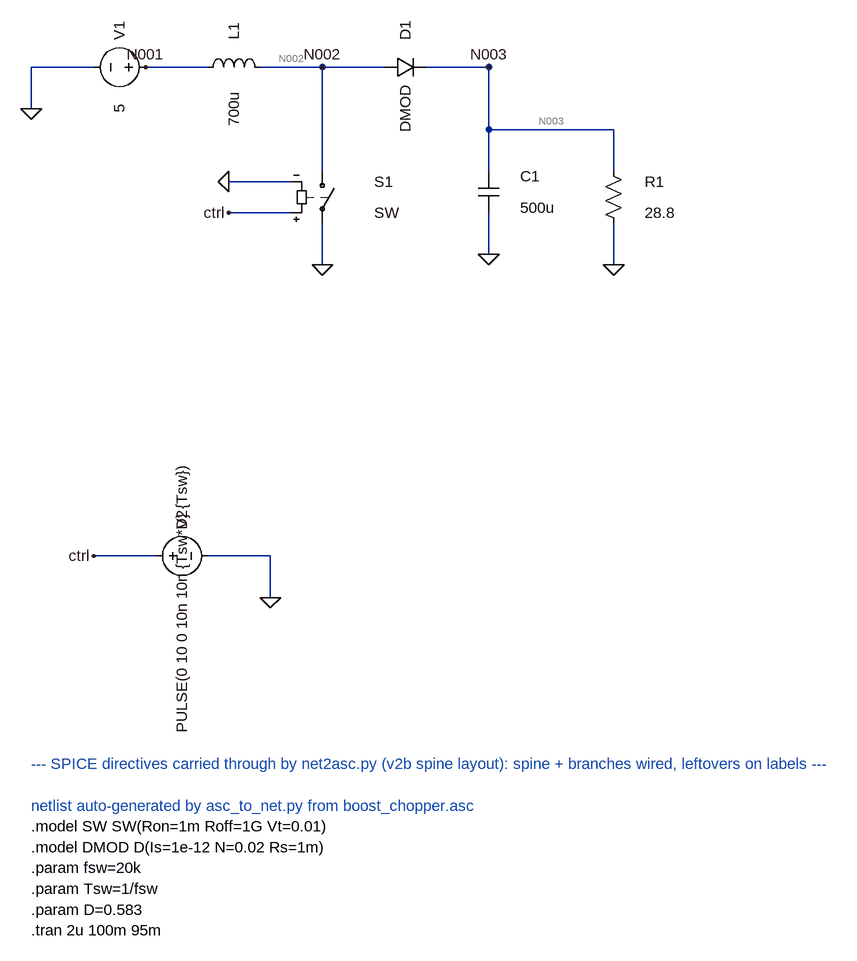
[diagram p0: schematic boost_chopper.asc]
boost_chopper.asc, the LTspice schematic file:
Version 4
SHEET 1 2080 1648
WIRE 64 128 64 192
WIRE 64 128 160 128
WIRE 240 128 336 128
WIRE 416 128 512 128
WIRE 512 128 608 128
WIRE 672 128 768 128
WIRE 512 128 512 224
WIRE 512 224 512 288
WIRE 464 352 368 352
WIRE 464 304 368 304
WIRE 512 368 512 432
WIRE 768 128 768 224
WIRE 768 224 768 288
WIRE 768 352 768 416
WIRE 768 128 768 224
WIRE 768 224 960 224
WIRE 960 224 960 288
WIRE 960 368 960 432
WIRE 160 880 256 880
WIRE 336 880 432 880
WIRE 432 880 432 944
FLAG 64 192 0
FLAG 512 128 N002
FLAG 768 128 N003
FLAG 368 352 ctrl
FLAG 368 304 0
FLAG 512 432 0
FLAG 768 416 0
FLAG 960 432 0
FLAG 160 880 ctrl
FLAG 432 944 0
FLAG 240 128 N001
SYMBOL voltage 256 128 R90
WINDOW 0 -56 56 Center 2
WINDOW 3 64 56 Center 2
SYMATTR InstName V1
SYMATTR Value 5
SYMBOL ind 320 144 R270
WINDOW 0 72 56 Center 2
WINDOW 3 -48 56 Center 2
SYMATTR InstName L1
SYMATTR Value 700u
SYMBOL diode 608 144 R270
WINDOW 0 72 32 Center 2
WINDOW 3 -48 32 Center 2
SYMATTR InstName D1
SYMATTR Value DMOD
SYMBOL sw 512 272 R0
WINDOW 0 80 32 Left 2
WINDOW 3 80 80 Left 2
SYMATTR InstName S1
SYMATTR Value SW
SYMBOL cap 752 288 R0
WINDOW 0 64 8 Left 2
WINDOW 3 64 56 Left 2
SYMATTR InstName C1
SYMATTR Value 500u
SYMBOL res 944 272 R0
WINDOW 0 64 32 Left 2
WINDOW 3 64 80 Left 2
SYMATTR InstName R1
SYMATTR Value 28.8
SYMBOL voltage 240 880 R270
WINDOW 0 56 56 Center 2
WINDOW 3 -64 56 Center 2
SYMATTR InstName V2
SYMATTR Value PULSE(0 10 0 10n 10n {Tsw*D} {Tsw})
TEXT 64 1200 Left 2 ;--- SPICE directives carried through by net2asc.py (v2b spine layout): spine + branches wired, leftovers on labels ---
TEXT 64 1264 Left 2 ;netlist auto-generated by asc_to_net.py from boost_chopper.asc
TEXT 64 1296 Left 2 !.model SW SW(Ron=1m Roff=1G Vt=0.01)
TEXT 64 1328 Left 2 !.model DMOD D(Is=1e-12 N=0.02 Rs=1m)
TEXT 64 1360 Left 2 !.param fsw=20k
TEXT 64 1392 Left 2 !.param Tsw=1/fsw
TEXT 64 1424 Left 2 !.param D=0.583
TEXT 64 1456 Left 2 !.tran 2u 100m 95m

The netlist it stands for:
* boost_chopper.asc
V1 N001 0 5
L1 N001 N002 700u
D1 N002 N003 DMOD
S1 N002 0 ctrl 0 SW
C1 N003 0 500u
R1 N003 0 28.8
V2 ctrl 0 PULSE(0 10 0 10n 10n {Tsw*D} {Tsw})
.model D D
.lib standard.dio
* --- SPICE directives carried through by net2asc.py (v2b spine layout): spine + branches wired, leftovers on labels ---
* netlist auto-generated by asc_to_net.py from boost_chopper.asc
.model SW SW(Ron=1m Roff=1G Vt=0.01)
.model DMOD D(Is=1e-12 N=0.02 Rs=1m)
.param fsw=20k
.param Tsw=1/fsw
.param D=0.583
.tran 2u 100m 95m
.backanno
.end

* Results of the author's LTspice run, read from the files saved beside the schematic
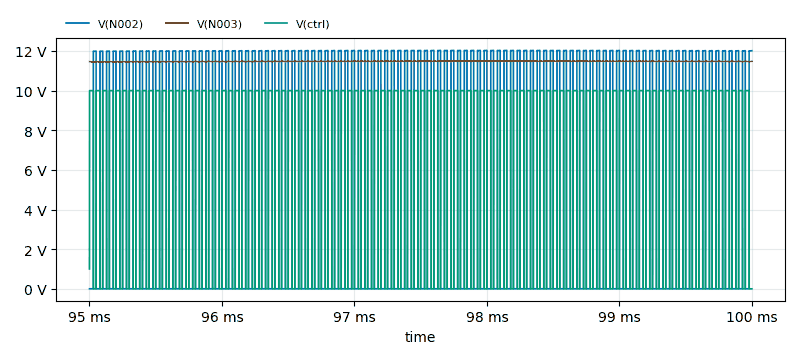
[diagram p1: Transient Analysis of boost_chopper.asc, plotted from the saved traces]
* Transient Analysis, 1 run:
*   V(N002): min 835 µV, max 12.03 V, average 5.017 V, rms 7.762 V, last 12.01 V
*   V(N003): min 11.44 V, max 11.5 V, average 11.48 V, rms 11.48 V, last 11.48 V
*   V(ctrl): min 0 V, max 10 V, average 5.823 V, rms 7.63 V, last 0 V